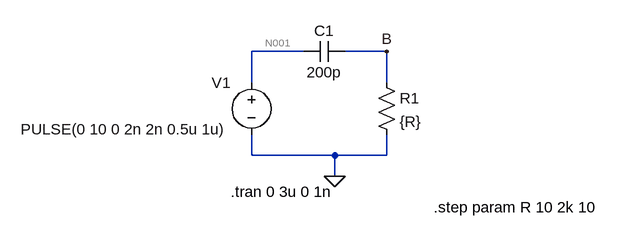
[diagram p0: schematic 3c.asc]
3c.asc, the LTspice schematic file:
Version 4
SHEET 1 880 680
WIRE -32 112 -112 112
WIRE 96 112 32 112
WIRE -112 160 -112 112
WIRE 96 160 96 112
WIRE -112 272 -112 240
WIRE 16 272 -112 272
WIRE 96 272 96 240
WIRE 96 272 16 272
WIRE 16 304 16 272
FLAG 16 304 0
FLAG 96 112 B
SYMBOL voltage -112 144 R0
WINDOW 3 -355 88 Left 2
WINDOW 123 0 0 Left 0
WINDOW 39 0 0 Left 0
WINDOW 0 -61 16 Left 2
SYMATTR Value PULSE(0 10 0 2n 2n 0.5u 1u)
SYMATTR InstName V1
SYMBOL res 80 144 R0
SYMATTR InstName R1
SYMATTR Value {R}
SYMBOL cap 32 96 R90
WINDOW 0 0 32 VBottom 2
WINDOW 3 32 32 VTop 2
SYMATTR InstName C1
SYMATTR Value 200p
TEXT -144 328 Left 2 !.tran 0 3u 0 1n
TEXT 168 352 Left 2 !.step param R 10 2k 10

The netlist it stands for:
* 3c.asc
V1 N001 0 PULSE(0 10 0 2n 2n 0.5u 1u)
R1 B 0 {R}
C1 B N001 200p
.tran 0 3u 0 1n
.step param R 10 2k 10
.backanno
.end

* Results of the author's LTspice run, read from the files saved beside the schematic
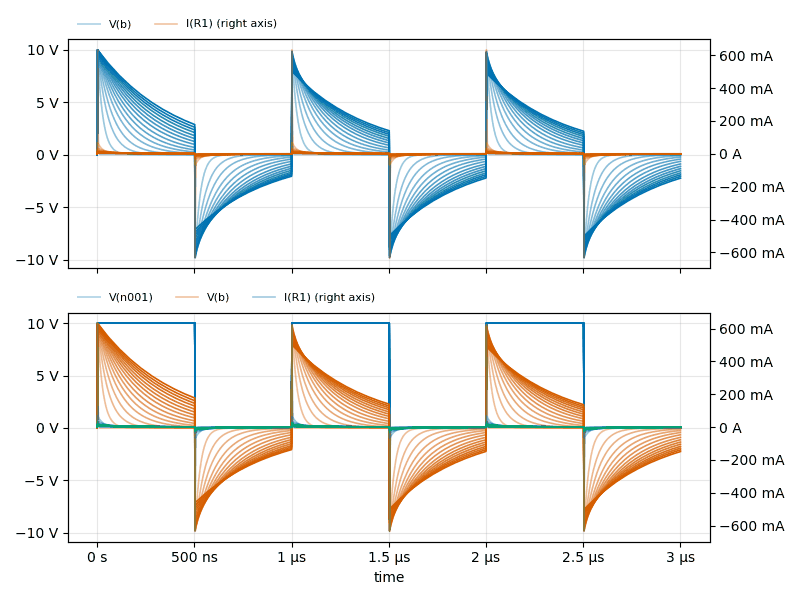
[diagram p1: Transient Analysis of 3c.asc, plotted from the saved traces]
* Transient Analysis, 200 runs:
*   V(b) [run 1]: min -6.344 V, max 6.327 V, average 102.6 µV, rms 391 mV, last 0 V
*   V(b) [run 2]: min -9.651 V, max 9.652 V, average 29.42 µV, rms 1.659 V, last 0 V
*   V(b) [run 3]: min -9.816 V, max 9.817 V, average 21.2 µV, rms 2.319 V, last -1.006 mV
*   V(b) [run 4]: min -9.857 V, max 9.876 V, average 544 µV, rms 2.823 V, last -20 mV
*   V(b) [run 5]: min -9.814 V, max 9.908 V, average 3.578 mV, rms 3.262 V, last -99.38 mV
*   V(b) [run 6]: min -9.697 V, max 9.926 V, average 10.71 mV, rms 3.592 V, last -239.4 mV
*   V(b) [run 7]: min -9.525 V, max 9.938 V, average 22.92 mV, rms 3.862 V, last -429.1 mV
*   V(b) [run 8]: min -9.32 V, max 9.946 V, average 40.21 mV, rms 4.083 V, last -647.6 mV
*   I(R1) [run 1]: min -634.4 mA, max 632.7 mA, average 10.26 µA, rms 39.1 mA, last 0 A
*   I(R1) [run 2]: min -68.93 mA, max 68.94 mA, average 210.1 nA, rms 11.85 mA, last 0 A
*   I(R1) [run 3]: min -36.36 mA, max 36.36 mA, average 78.53 nA, rms 8.587 mA, last -3.727 µA
*   I(R1) [run 4]: min -24.64 mA, max 24.69 mA, average 1.36 µA, rms 7.058 mA, last -50.01 µA
*   I(R1) [run 5]: min -18.17 mA, max 18.35 mA, average 6.626 µA, rms 6.041 mA, last -184 µA
*   I(R1) [run 6]: min -14.47 mA, max 14.81 mA, average 15.99 µA, rms 5.361 mA, last -357.3 µA
*   I(R1) [run 7]: min -11.91 mA, max 12.42 mA, average 28.65 µA, rms 4.827 mA, last -536.4 µA
*   I(R1) [run 8]: min -10.02 mA, max 10.7 mA, average 43.24 µA, rms 4.39 mA, last -696.3 µA
*   V(n001) [run 1]: min 0 V, max 10 V, average 5.02 V, rms 7.081 V, last 0 V
*   V(n001) [run 2]: min 0 V, max 10 V, average 5.02 V, rms 7.081 V, last 0 V
*   V(n001) [run 3]: min 0 V, max 10 V, average 5.02 V, rms 7.081 V, last 0 V
*   V(n001) [run 4]: min 0 V, max 10 V, average 5.02 V, rms 7.081 V, last 0 V
*   V(n001) [run 5]: min 0 V, max 10 V, average 5.02 V, rms 7.082 V, last 0 V
*   V(n001) [run 6]: min 0 V, max 10 V, average 5.02 V, rms 7.082 V, last 0 V
*   V(n001) [run 7]: min 0 V, max 10 V, average 5.02 V, rms 7.082 V, last 0 V
*   V(n001) [run 8]: min 0 V, max 10 V, average 5.02 V, rms 7.083 V, last 0 V
*   V(b) [run 1]: min -6.344 V, max 6.327 V, average 102.6 µV, rms 391 mV, last 0 V
*   V(b) [run 2]: min -9.651 V, max 9.652 V, average 29.42 µV, rms 1.659 V, last 0 V
*   V(b) [run 3]: min -9.816 V, max 9.817 V, average 21.2 µV, rms 2.319 V, last -1.006 mV
*   V(b) [run 4]: min -9.857 V, max 9.876 V, average 544 µV, rms 2.823 V, last -20 mV
*   V(b) [run 5]: min -9.814 V, max 9.908 V, average 3.578 mV, rms 3.262 V, last -99.38 mV
*   V(b) [run 6]: min -9.697 V, max 9.926 V, average 10.71 mV, rms 3.592 V, last -239.4 mV
*   V(b) [run 7]: min -9.525 V, max 9.938 V, average 22.92 mV, rms 3.862 V, last -429.1 mV
*   V(b) [run 8]: min -9.32 V, max 9.946 V, average 40.21 mV, rms 4.083 V, last -647.6 mV
*   I(R1) [run 1]: min -634.4 mA, max 632.7 mA, average 10.26 µA, rms 39.1 mA, last 0 A
*   I(R1) [run 2]: min -68.93 mA, max 68.94 mA, average 210.1 nA, rms 11.85 mA, last 0 A
*   I(R1) [run 3]: min -36.36 mA, max 36.36 mA, average 78.53 nA, rms 8.587 mA, last -3.727 µA
*   I(R1) [run 4]: min -24.64 mA, max 24.69 mA, average 1.36 µA, rms 7.058 mA, last -50.01 µA
*   I(R1) [run 5]: min -18.17 mA, max 18.35 mA, average 6.626 µA, rms 6.041 mA, last -184 µA
*   I(R1) [run 6]: min -14.47 mA, max 14.81 mA, average 15.99 µA, rms 5.361 mA, last -357.3 µA
*   I(R1) [run 7]: min -11.91 mA, max 12.42 mA, average 28.65 µA, rms 4.827 mA, last -536.4 µA
*   I(R1) [run 8]: min -10.02 mA, max 10.7 mA, average 43.24 µA, rms 4.39 mA, last -696.3 µA